# EAGLE design atmega8_bk (EAGLE 7.1.0)
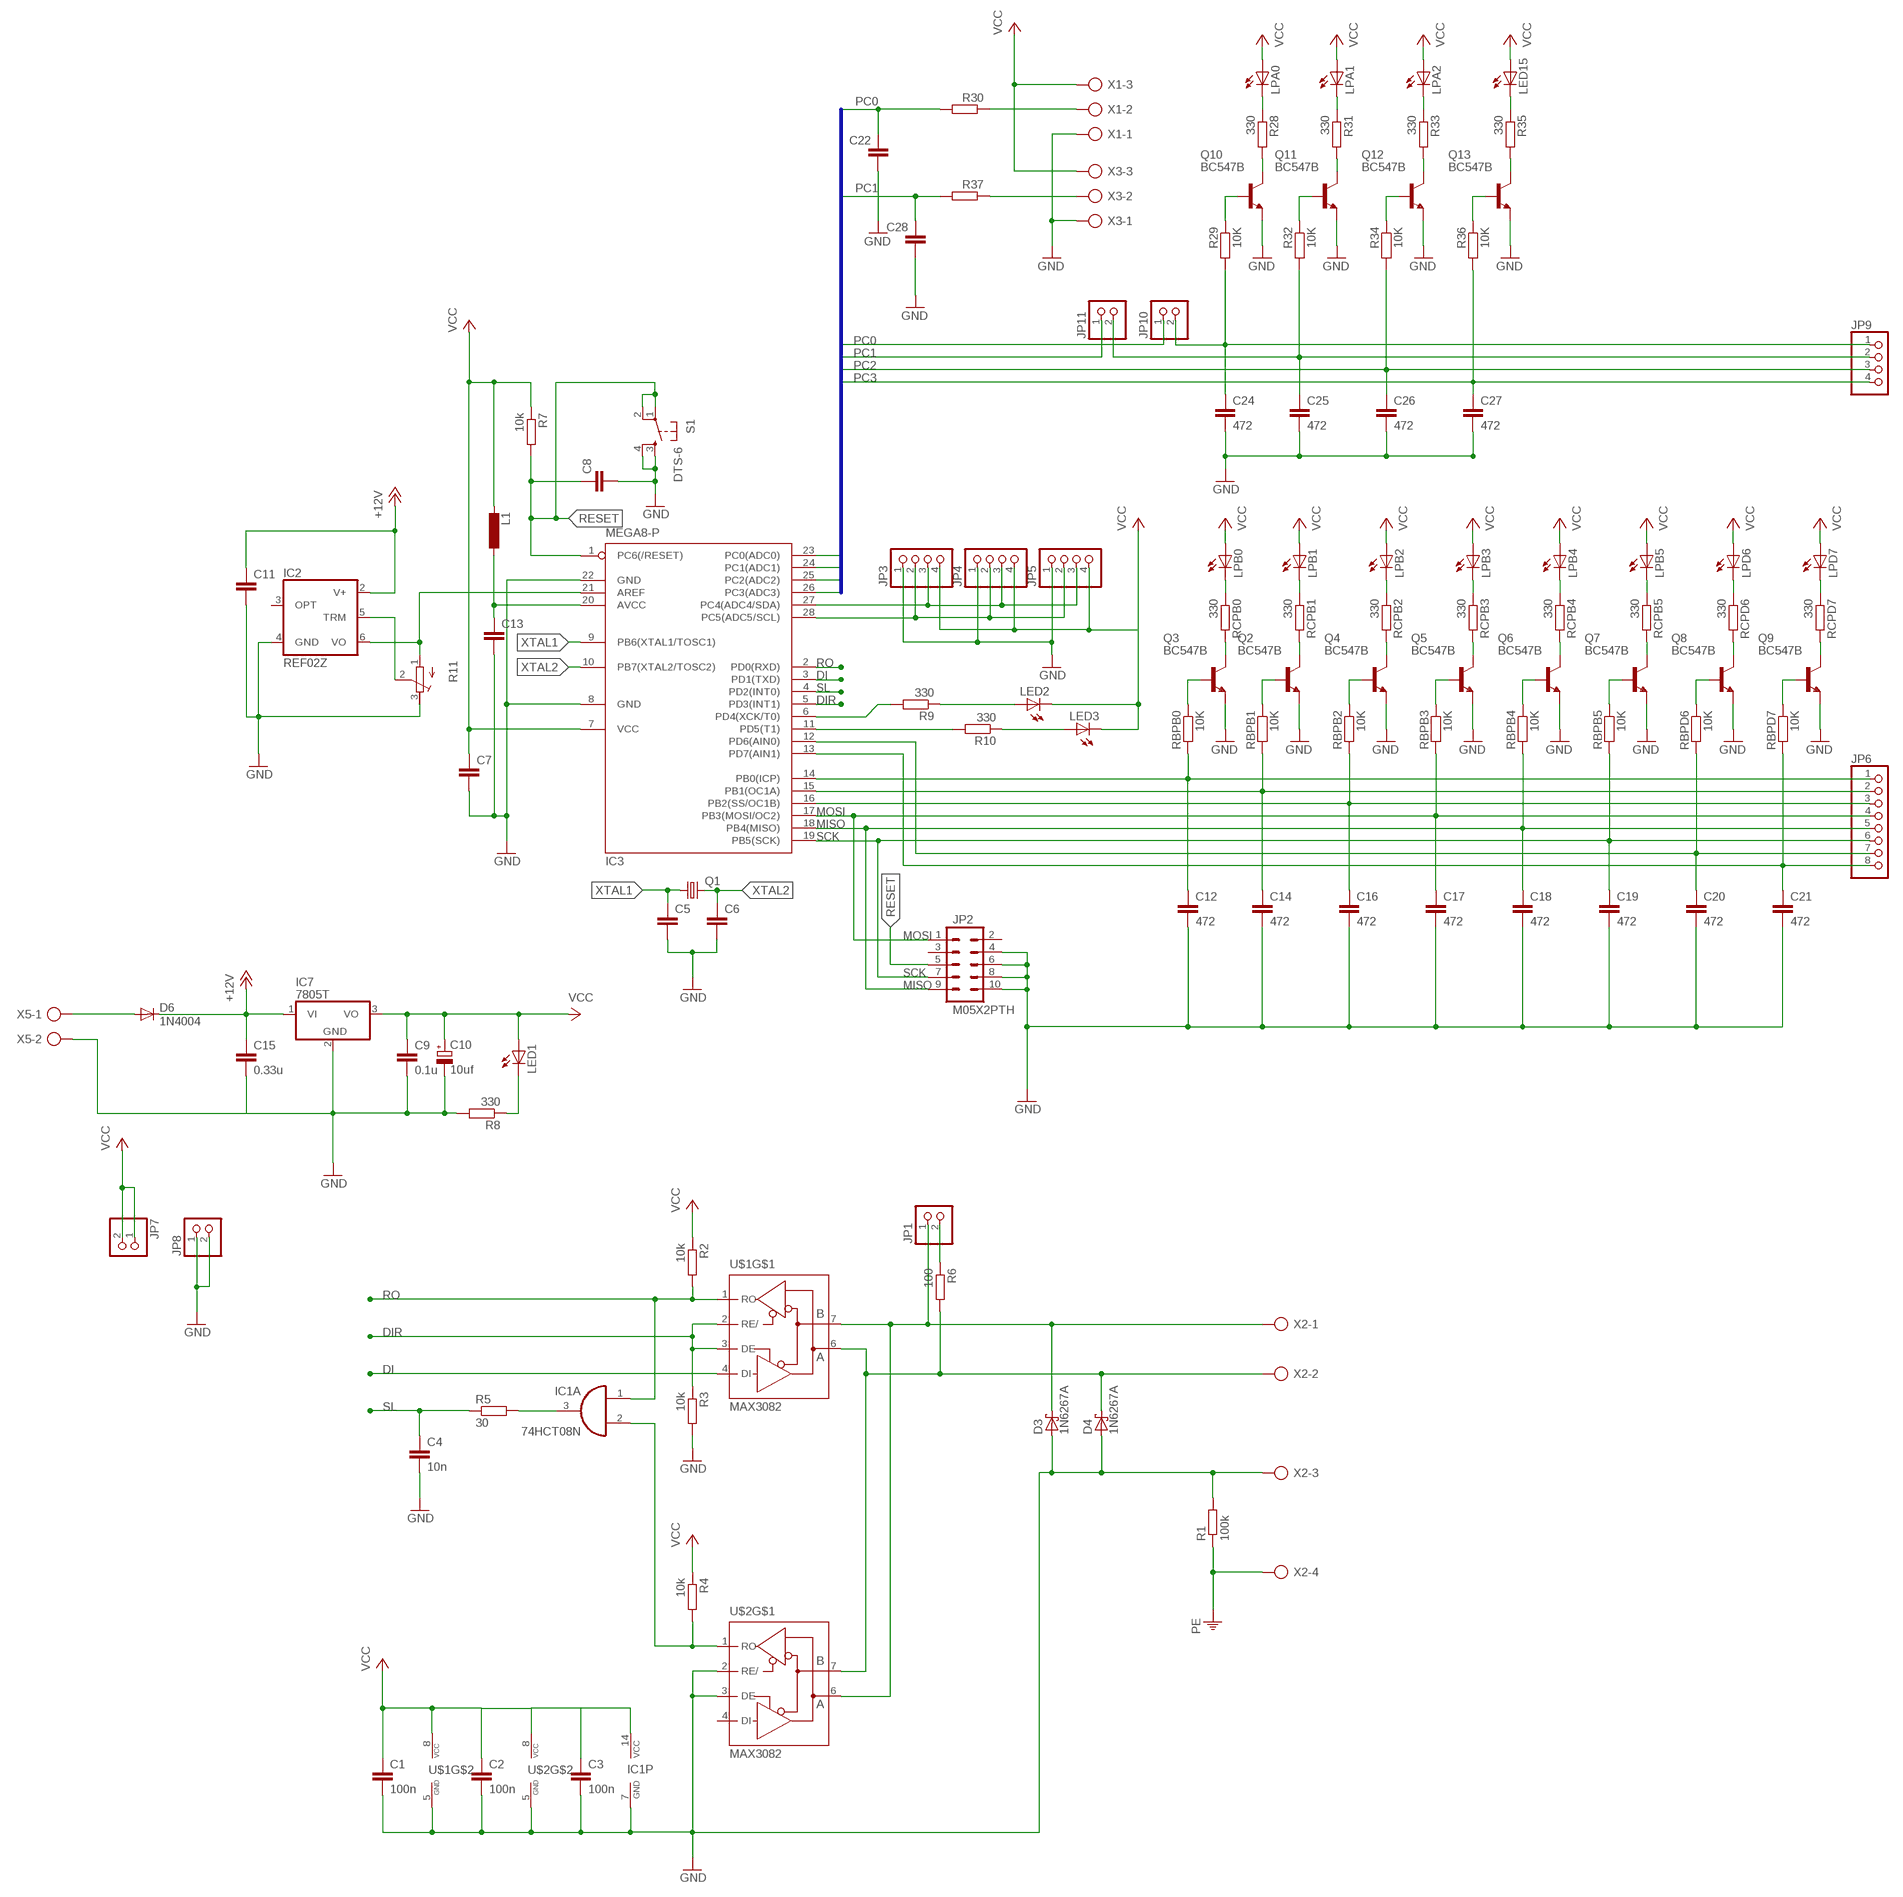
[diagram p0: schematic, sheet 1]

## Parts
C1  100n  C-EU050-035X075  [C050-035X075]
C2  100n  C-EU050-035X075  [C050-035X075]
C3  100n  C-EU050-035X075  [C050-035X075]
C4  10n  C-EU050-035X075  [C050-035X075]
C5  C-EU050-024X044  [C050-024X044]
C6  C-EU050-024X044  [C050-024X044]
C7  C-EU050-025X075  [C050-025X075]
C8  C-EU050-025X075  [C050-025X075]
C9  0.1u  C-EU025-024X044  [C025-024X044]
C10  10uf  CPOL-EUE2-4  [E2-4]
C11  C-EU050-025X075  [C050-025X075]
C12  472  C-EU050-024X044  [C050-024X044]
C13  C-EU050-025X075  [C050-025X075]
C14  472  C-EU050-024X044  [C050-024X044]
C15  0.33u  C-EU025-024X044  [C025-024X044]
C16  472  C-EU050-024X044  [C050-024X044]
C17  472  C-EU050-024X044  [C050-024X044]
C18  472  C-EU050-024X044  [C050-024X044]
C19  472  C-EU050-024X044  [C050-024X044]
C20  472  C-EU050-024X044  [C050-024X044]
C21  472  C-EU050-024X044  [C050-024X044]
C22  C-EU050-025X075  [C050-025X075]
C24  472  C-EU050-024X044  [C050-024X044]
C25  472  C-EU050-024X044  [C050-024X044]
C26  472  C-EU050-024X044  [C050-024X044]
C27  472  C-EU050-024X044  [C050-024X044]
C28  C-EU050-025X075  [C050-025X075]
D3  1N6267A  [C4111-15]
D4  1N6267A  [C4111-15]
D6  1N4004  [DO41-10]
IC1  74HCT08N  [DIL14]
IC2  REF02Z  [DIL08]
IC3  MEGA8-P  [DIL28-3]
IC7  7805T  [TO220H]
JP1  PINHD-1X2  [1X02]
JP2  M05X2PTH  [AVR_ICSP]
JP3  PINHD-1X4  [1X04]
JP4  PINHD-1X4  [1X04]
JP5  PINHD-1X4  [1X04]
JP6  PINHD-1X8  [1X08]
JP7  PINHD-1X2  [1X02]
JP8  PINHD-1X2  [1X02]
JP9  PINHD-1X4  [1X04]
JP10  PINHD-1X2  [1X02]
JP11  PINHD-1X2  [1X02]
L1  L-EU0207/12  [0207/12]
LED1  LED3MM  [LED3MM]
LED2  LED3MM  [LED3MM]
LED3  LED3MM  [LED3MM]
LED15  LED3MM  [LED3MM]
LPA0  LED3MM  [LED3MM]
LPA1  LED3MM  [LED3MM]
LPA2  LED3MM  [LED3MM]
LPB0  LED3MM  [LED3MM]
LPB1  LED3MM  [LED3MM]
LPB2  LED3MM  [LED3MM]
LPB3  LED3MM  [LED3MM]
LPB4  LED3MM  [LED3MM]
LPB5  LED3MM  [LED3MM]
LPD6  LED3MM  [LED3MM]
LPD7  LED3MM  [LED3MM]
Q1  CRYSTALHC49U70  [HC49U70]
Q2  BC547B  [TO92]
Q3  BC547B  [TO92]
Q4  BC547B  [TO92]
Q5  BC547B  [TO92]
Q6  BC547B  [TO92]
Q7  BC547B  [TO92]
Q8  BC547B  [TO92]
Q9  BC547B  [TO92]
Q10  BC547B  [TO92]
Q11  BC547B  [TO92]
Q12  BC547B  [TO92]
Q13  BC547B  [TO92]
R1  100k  R-EU_0204/7  [0204/7]
R2  10k  R-EU_0204/7  [0204/7]
R3  10k  R-EU_0204/7  [0204/7]
R4  10k  R-EU_0204/7  [0204/7]
R5  30  R-EU_0207/10  [0207/10]
R6  100  R-EU_0204/7  [0204/7]
R7  10k  R-EU_0204/7  [0204/7]
R8  330  R-EU_0204/7  [0204/7]
R9  330  R-EU_0204/7  [0204/7]
R10  330  R-EU_0204/7  [0204/7]
R11  R-TRIMM64W  [RTRIM64W]
R28  330  R-EU_0204/7  [0204/7]
R29  10K  R-EU_0204/7  [0204/7]
R30  R-EU_0204/7  [0204/7]
R31  330  R-EU_0204/7  [0204/7]
R32  10K  R-EU_0204/7  [0204/7]
R33  330  R-EU_0204/7  [0204/7]
R34  10K  R-EU_0204/7  [0204/7]
R35  330  R-EU_0204/7  [0204/7]
R36  10K  R-EU_0204/7  [0204/7]
R37  R-EU_0204/7  [0204/7]
RBPB0  10K  R-EU_0204/7  [0204/7]
RBPB1  10K  R-EU_0204/7  [0204/7]
RBPB2  10K  R-EU_0204/7  [0204/7]
RBPB3  10K  R-EU_0204/7  [0204/7]
RBPB4  10K  R-EU_0204/7  [0204/7]
RBPB5  10K  R-EU_0204/7  [0204/7]
RBPD6  10K  R-EU_0204/7  [0204/7]
RBPD7  10K  R-EU_0204/7  [0204/7]
RCPB0  330  R-EU_0204/7  [0204/7]
RCPB1  330  R-EU_0204/7  [0204/7]
RCPB2  330  R-EU_0204/7  [0204/7]
RCPB3  330  R-EU_0204/7  [0204/7]
RCPB4  330  R-EU_0204/7  [0204/7]
RCPB5  330  R-EU_0204/7  [0204/7]
RCPD6  330  R-EU_0204/7  [0204/7]
RCPD7  330  R-EU_0204/7  [0204/7]
S1  DTS-6  [DTS-6]
U$1  MAX3082  [DIL08]
U$2  MAX3082  [DIL08]
X1  AK500/3  [AK500/3]
X2  AK500/4  [AK500/4]
X3  AK500/3  [AK500/3]
X5  AK500/2  [AK500/2]

## Nets
+12V: C11.1 C15.1 D6.C IC2.2(V+) IC7.1(VI)
AREF: IC2.6(VO) IC3.21(AREF) R11.1(A)
DI: IC3.3(PD1(TXD)) U$1.4(DI)
DIR: IC3.5(PD3(INT1)) R3.1 U$1.2(RE/) U$1.3(DE)
GND: C1.2 C2.2 C3.2 C4.2 C5.2 C6.2 C7.2 C8.2 C9.2 C10.- C11.2 C12.2 C13.2 C14.2 C15.2 C16.2 C17.2 C18.2 C19.2 C20.2 C21.2 C22.2 C24.2 C25.2 C26.2 C27.2 C28.2 D3.A D4.A IC1.7(P:GND) IC2.4(GND) IC3.8(GND) IC3.22(GND) IC7.2(GND) JP2.4 JP2.6 JP2.8 JP2.10 JP3.1 JP4.1 JP5.1 JP8.1 JP8.2 Q2.1(E) Q3.1(E) Q4.1(E) Q5.1(E) Q6.1(E) Q7.1(E) Q8.1(E) Q9.1(E) Q10.1(E) Q11.1(E) Q12.1(E) Q13.1(E) R1.2 R3.2 R8.2 R11.3(E) S1.3 S1.4 U$1.5(GND) U$2.2(RE/) U$2.3(DE) U$2.5(GND) X1.1 X2.3 X3.1 X5.2
LPA3: LED15.K(C) R35.1
MISO: C18.1 IC3.18(PB4(MISO)) JP2.9 JP6.5 RBPB4.2
MOSI: C17.1 IC3.17(PB3(MOSI/OC2)) JP2.1 JP6.4 RBPB3.2
N$1: LPB0.K(C) RCPB0.1
N$2: D4.C R6.2 U$1.6(A) U$2.7(B) X2.2
N$3: IC1.2(A:I1) R4.2 U$2.1(RO)
N$4: LED1.K(C) R8.1
N$5: LED3.A R10.1
N$6: IC2.5(TRM) R11.2(S)
N$7: IC1.3(A:O) R5.2
N$8: JP1.2 R6.1
N$9: D3.C JP1.1 U$1.7(B) U$2.6(A) X2.1
N$10: C13.1 IC3.20(AVCC) L1.1
N$11: Q3.3(C) RCPB0.2
N$12: Q3.2(B) RBPB0.1
N$13: C12.1 IC3.14(PB0(ICP)) JP6.1 RBPB0.2
N$14: C14.1 IC3.15(PB1(OC1A)) JP6.2 RBPB1.2
N$15: C16.1 IC3.16(PB2(SS/OC1B)) JP6.3 RBPB2.2
N$16: C20.1 IC3.12(PD6(AIN0)) JP6.7 RBPD6.2
N$17: C21.1 IC3.13(PD7(AIN1)) JP6.8 RBPD7.2
N$18: IC3.28(PC5(ADC5/SCL)) JP3.2 JP4.2 JP5.2
N$19: D6.A X5.1
N$20: Q2.3(C) RCPB1.2
N$21: Q2.2(B) RBPB1.1
N$23: IC3.27(PC4(ADC4/SDA)) JP3.3 JP4.3 JP5.3
N$25: IC3.6(PD4(XCK/T0)) R9.2
N$26: IC3.11(PD5(T1)) R10.2
N$27: LPB1.K(C) RCPB1.1
N$28: LED2.A R9.1
N$29: Q4.3(C) RCPB2.2
N$30: Q4.2(B) RBPB2.1
N$31: LPB2.K(C) RCPB2.1
N$32: Q5.3(C) RCPB3.2
N$33: Q5.2(B) RBPB3.1
N$34: LPB3.K(C) RCPB3.1
N$35: Q6.3(C) RCPB4.2
N$36: Q6.2(B) RBPB4.1
N$37: LPB4.K(C) RCPB4.1
N$38: Q7.3(C) RCPB5.2
N$39: Q7.2(B) RBPB5.1
N$40: LPB5.K(C) RCPB5.1
N$41: Q8.3(C) RCPD6.2
N$42: Q8.2(B) RBPD6.1
N$43: LPD6.K(C) RCPD6.1
N$44: Q9.3(C) RCPD7.2
N$45: Q9.2(B) RBPD7.1
N$46: LPD7.K(C) RCPD7.1
N$47: R30.1 X1.2
N$48: Q10.3(C) R28.2
N$49: Q10.2(B) R29.1
N$50: C24.1 JP9.1 JP10.2 R29.2
N$51: C25.1 JP9.2 JP11.2 R32.2
N$53: LPA0.K(C) R28.1
N$54: Q11.3(C) R31.2
N$55: Q11.2(B) R32.1
N$56: LPA1.K(C) R31.1
N$57: Q12.3(C) R33.2
N$58: Q12.2(B) R34.1
N$59: LPA2.K(C) R33.1
N$60: Q13.3(C) R35.2
N$61: Q13.2(B) R36.1
N$71: R37.1 X3.2
PC0: C22.1 IC3.23(PC0(ADC0)) JP10.1 R30.2
PC1: C28.1 IC3.24(PC1(ADC1)) JP11.1 R37.2
PC2: C26.1 IC3.25(PC2(ADC2)) JP9.3 R34.2
PC3: C27.1 IC3.26(PC3(ADC3)) JP9.4 R36.2
PE: R1.1 X2.4
RESET: C8.1 IC3.1(PC6(/RESET)) JP2.5 R7.2 S1.1 S1.2
RO: IC1.1(A:I0) IC3.2(PD0(RXD)) R2.2 U$1.1(RO)
SCK: C19.1 IC3.19(PB5(SCK)) JP2.7 JP6.6 RBPB5.2
SL: C4.1 IC3.4(PD2(INT0)) R5.1
VCC: C1.1 C2.1 C3.1 C7.1 C9.1 C10.+ IC1.14(P:VCC) IC3.7(VCC) IC7.3(VO) JP3.4 JP4.4 JP5.4 JP7.1 JP7.2 L1.2 LED1.A LED2.K(C) LED3.K(C) LED15.A LPA0.A LPA1.A LPA2.A LPB0.A LPB1.A LPB2.A LPB3.A LPB4.A LPB5.A LPD6.A LPD7.A R2.1 R4.1 R7.1 U$1.8(VCC) U$2.8(VCC) X1.3 X3.3
XTAL1: C5.1 IC3.9(PB6(XTAL1/TOSC1)) Q1.1
XTAL2: C6.1 IC3.10(PB7(XTAL2/TOSC2)) Q1.2
Unconnected: IC1.4(B:I0) IC1.5(B:I1) IC1.6(B:O) IC1.8(C:O) IC1.9(C:I0) IC1.10(C:I1) IC1.11(D:O) IC1.12(D:I0) IC1.13(D:I1) IC2.3(OPT) JP2.2 JP2.3 U$2.4(DI)

## Buses
PC[0..3]

## Library data of the parts
C1-C9 C11-C22 C24-C28 = rcl:C-EU: CAPACITOR, European symbol
C10 = rcl:CPOL-EU: POLARIZED CAPACITOR, European symbol
D3 D4 = diode:1N6267A: DIODE transient voltage suppressor
D6 = diode:1N4004: DIODE general purpose rectifier, 1 A
IC1 = 74xx-eu:74*08: Quad 2-input AND gate
IC2 = linear:REF02: VOLTAGE REFERENCE
IC3 = atmel:MEGA8-P: MICROCONTROLLER 8 Kbytes FLASH, 1 kbytes SRAM, 512 bytes EEPROM, USART, 4-channel 10 bit ADC, 2-channel 8 bit ADC Pin compatible with Atmega48, ATMega88, ATMega168 Source: avr.lbr; OC_FARNELL: unknown; OC_NEWARK: unknown
IC7 = linear:78*: Positive VOLTAGE REGULATOR Source: http://cache.national.com/ds/LM/LM78L05.pdf http://www.fairchildsemi.com/ds/LM/LM7805.pdf
JP1 JP7 JP8 JP10 JP11 = pinhead:PINHD-1X2: PIN HEADER
JP2 = SparkFun:M05X2: Header 5x2 Standard 10-pin dual row 0.1" header. Commonly used with AVR-ISP. Use with Spark Fun Electronics SKU: PRT-00778
JP3-JP5 JP9 = pinhead:PINHD-1X4: PIN HEADER
JP6 = pinhead:PINHD-1X8: PIN HEADER
L1 = rcl:L-EU: INDUCTOR, European symbol
LED1-LED3 LED15 LPA0 LPA1 LPA2 LPB0 LPB1-LPB5 LPD6 LPD7 = led:LED: LED OSRAM: - CHIPLED LG R971, LG N971, LY N971, LG Q971, LY Q971, LO R971, LY R971 LH N974, LH R974 LS Q976, LO Q976, LY Q976 LO Q996 - Hyper CHIPLED LW Q18S LB Q993, LB Q99A, LB R99A - SideLED LS A670, LO A670, LY A670, LG A670, LP A670 LB A673, LV A673, LT A673, LW A673 LH A674 LY A675 LS A676, LA A676, LO A676, LY A676, LW A676 LS A679, LY A679, LG A679 - Hyper Micro SIDELED® LS Y876, LA Y876, LO Y876, LY Y876 LT Y87S - SmartLED LW L88C, LW L88S LB L89C, LB L89S, LG L890 LS L89K, LO L89K, LY L89K LS L896, LA L896, LO L896, LY L896 - TOPLED LS T670, LO T670, LY T670, LG T670, LP T670 LSG T670, LSP T670, LSY T670, LOP T670, LYG T670 LG T671, LOG T671, LSG T671 LB T673, LV T673, LT T673, LW T673 LH T674 LS T676, LA T676, LO T676, LY T676, LB T676, LH T676, LSB T676, LW T676 LB T67C, LV T67C, LT T67C, LS T67K, LO T67K, LY T67K, LW E67C LS E67B, LA E67B, LO E67B, LY E67B, LB E67C, LV E67C, LT E67C LW T67C LS T679, LY T679, LG T679 LS T770, LO T770, LY T770, LG T770, LP T770 LB T773, LV T773, LT T773, LW T773 LH T774 LS E675, LA E675, LY E675, LS T675 LS T776, LA T776, LO T776, LY T776, LB T776 LHGB T686 LT T68C, LB T68C - Hyper Mini TOPLED® LB M676 - Mini TOPLED Santana® LG M470 LS M47K, LO M47K, LY M47K Source: http://www.osram.convergy.de LUXEON: - LUMILED® LXK2-PW12-R00, LXK2-PW12-S00, LXK2-PW14-U00, LXK2-PW14-V00 LXK2-PM12-R00, LXK2-PM12-S00, LXK2-PM14-U00 LXK2-PE12-Q00, LXK2-PE12-R00, LXK2-PE12-S00, LXK2-PE14-T00, LXK2-PE14-U00 LXK2-PB12-K00, LXK2-PB12-L00, LXK2-PB12-M00, LXK2-PB14-N00, LXK2-PB14-P00, LXK2-PB14-Q00 LXK2-PR12-L00, LXK2-PR12-M00, LXK2-PR14-Q00, LXK2-PR14-R00 LXK2-PD12-Q00, LXK2-PD12-R00, LXK2-PD12-S00 LXK2-PH12-R00, LXK2-PH12-S00 LXK2-PL12-P00, LXK2-PL12-Q00, LXK2-PL12-R00 Source: www.luxeon.com KINGBRIGHT: KA-3528ASYC Source: www.kingbright.com
Q1 = crystal:CRYSTAL: CRYSTAL; OC_FARNELL: unknown; OC_NEWARK: unknown
Q2-Q13 = transistor-npn:BC547*: NPN Transistor
R1-R4 R6 = resistor:R-EU_: RESISTOR, European symbol
R5 R7-R10 R28-R37 RBPB0 RBPB1-RBPB5 RBPD6 RBPD7 RCPB0 RCPB1-RCPB5 RCPD6 RCPD7 = rcl:R-EU_: RESISTOR, European symbol
R11 = rcl:R-TRIMM: Trimm resistor
S1 = switch-tact:DTS-6
U$1 U$2 = maxim:MAX3082
X1 X3 = con-ptr500:AK500/3: CONNECTOR; OC_FARNELL: unknown; OC_NEWARK: unknown
X2 = con-ptr500:AK500/4: CONNECTOR; OC_FARNELL: unknown; OC_NEWARK: unknown
X5 = con-ptr500:AK500/2: CONNECTOR; OC_FARNELL: unknown; OC_NEWARK: unknown

## Board
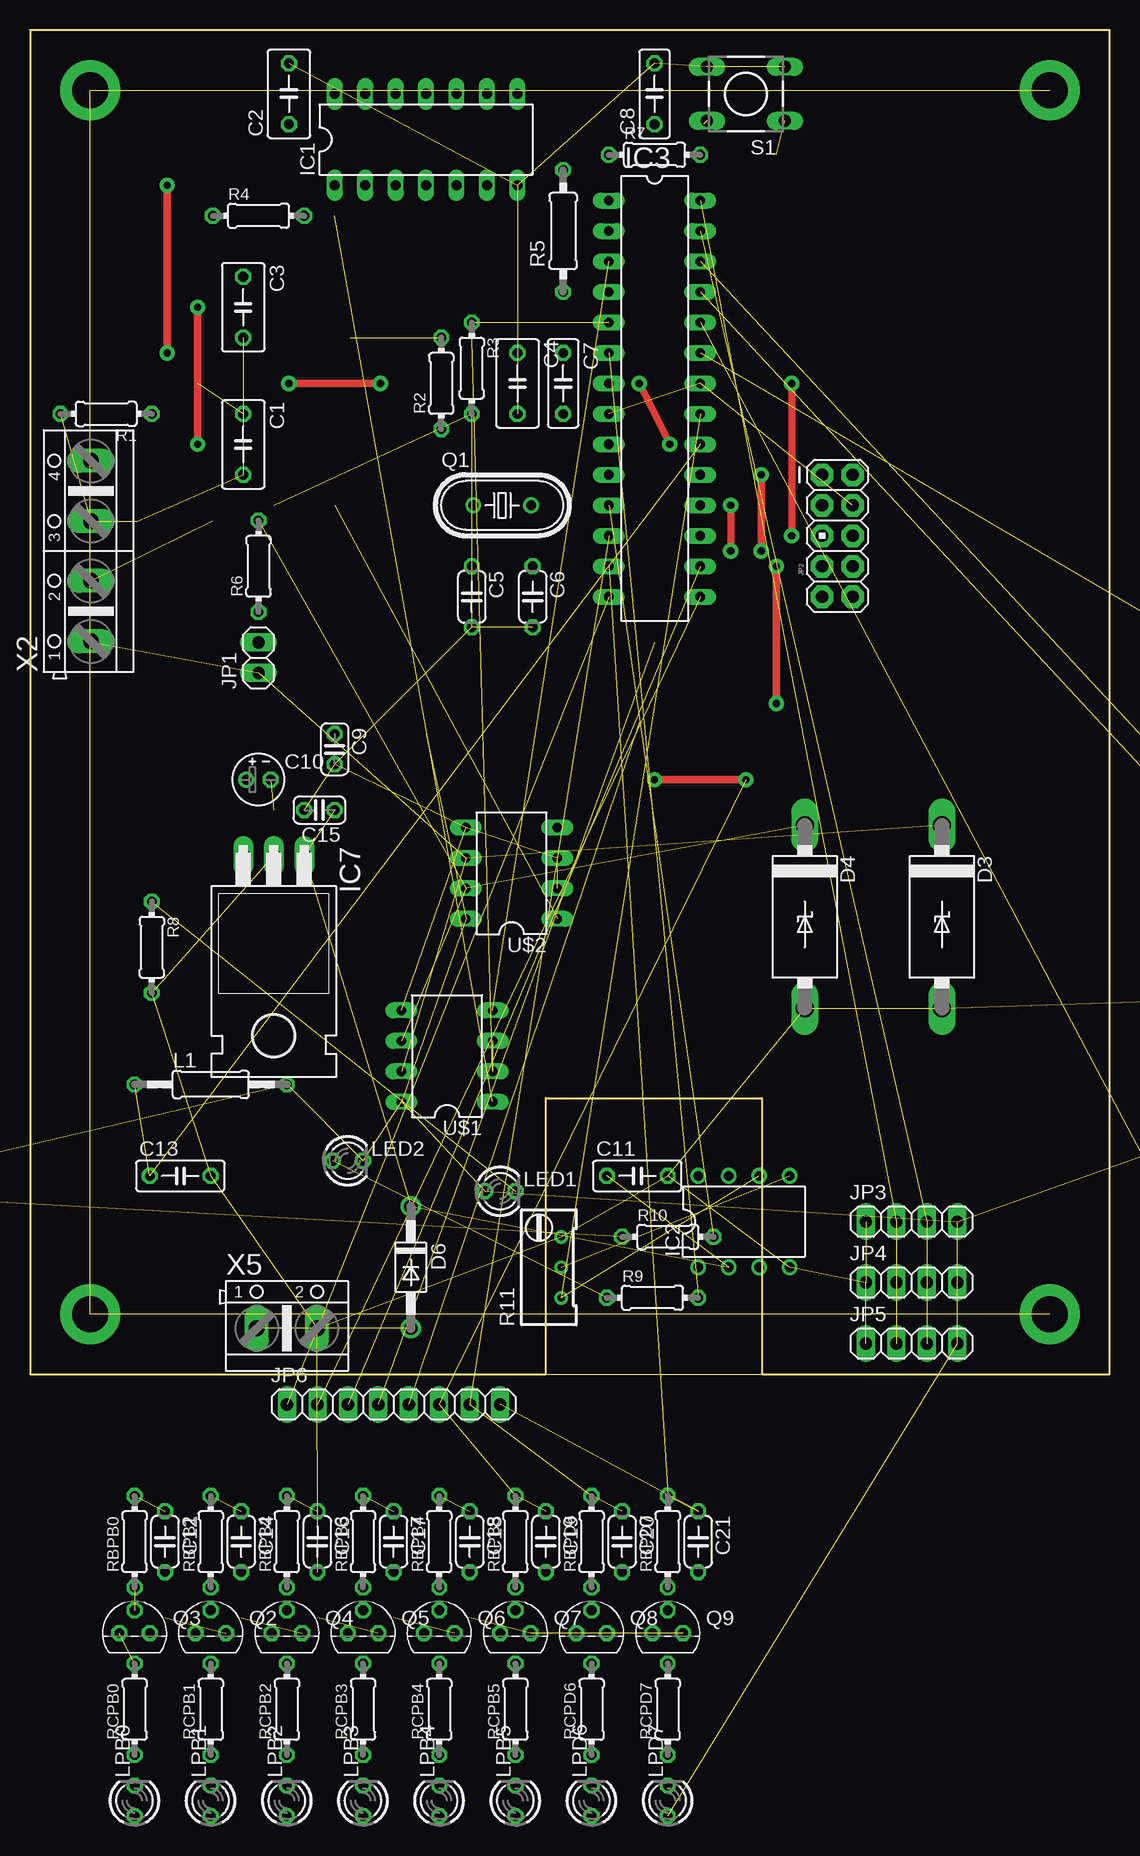
[diagram p1: board, top side]
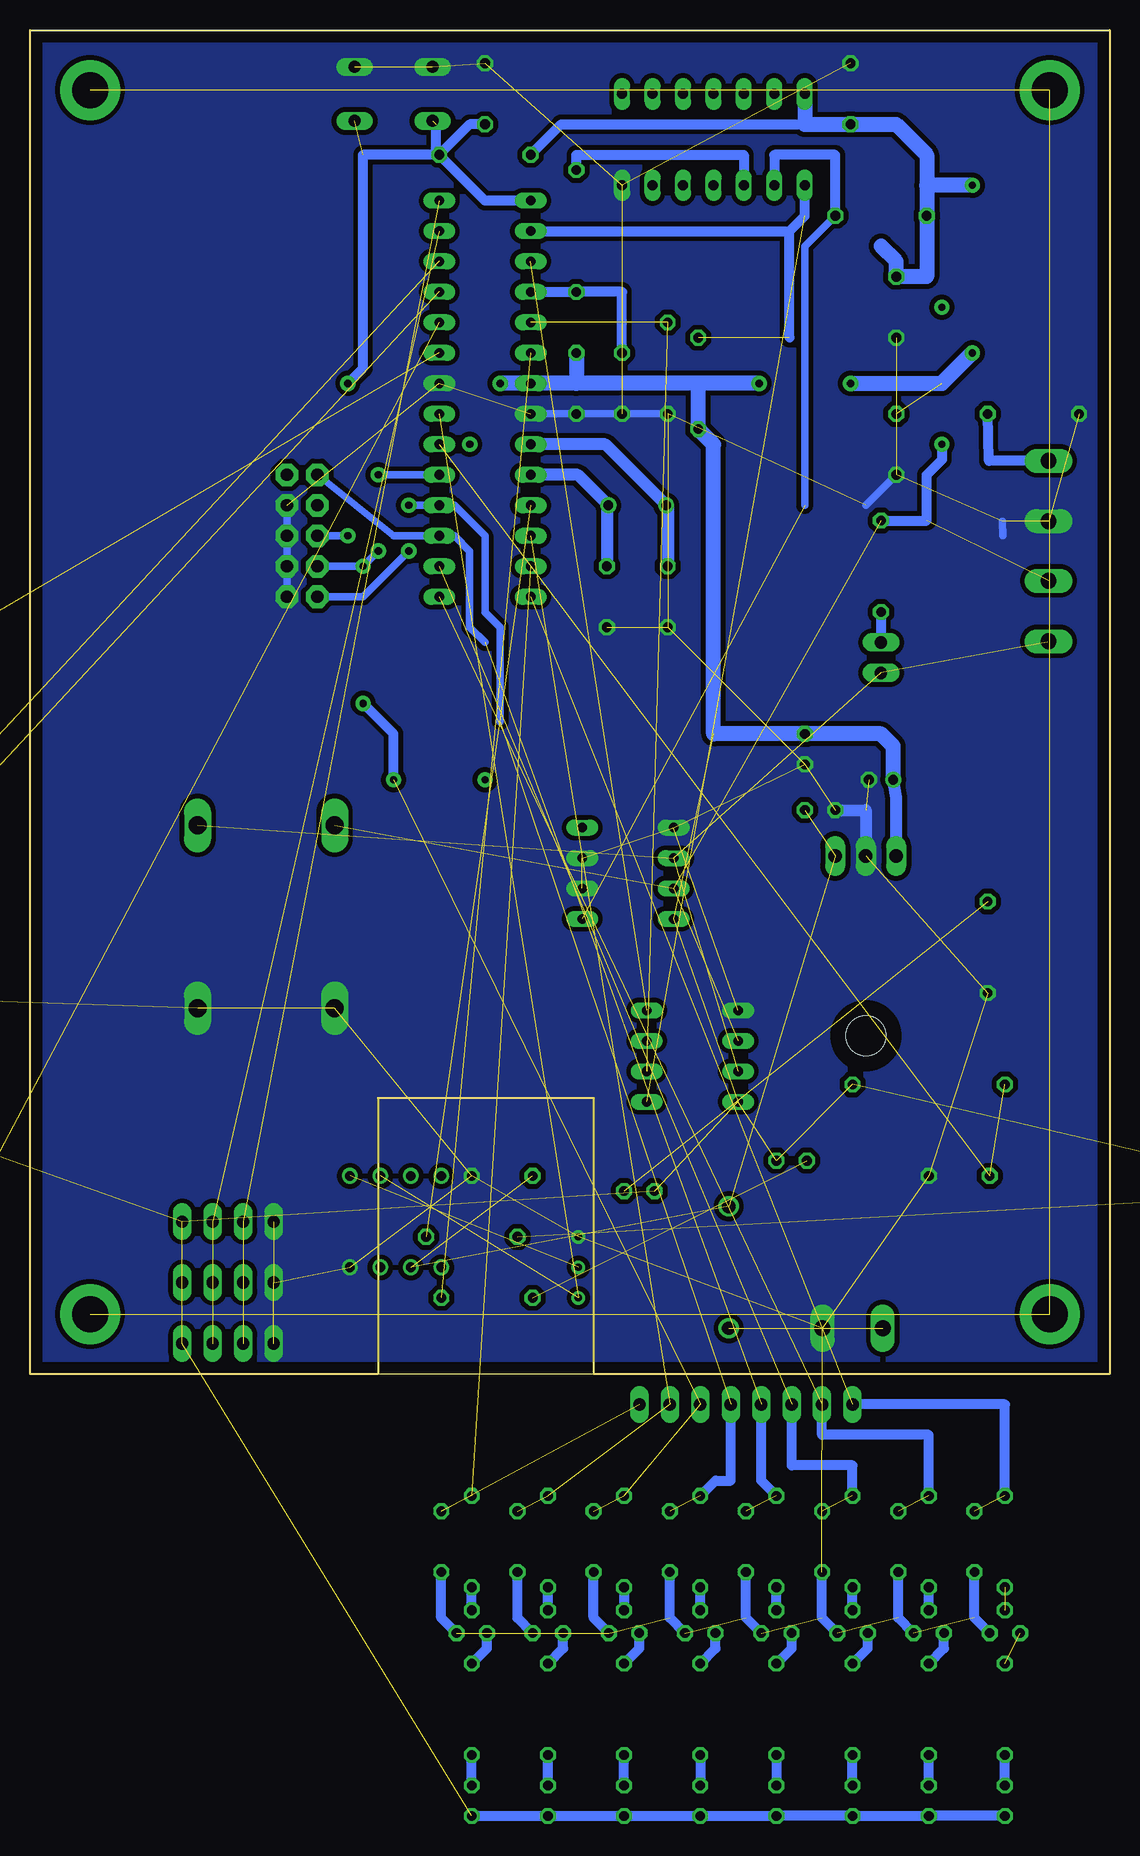
[diagram p2: board, bottom side, seen from below]

Size 90 x 112 mm. Coordinates in mm from the lower left corner, seen from the top.
Outline: 0,0 90,0 90,112 0,112 0,0
Copper layers (1*16): Top 0.035mm / dielectric 1.5mm / Bottom 0.035mm
Design rules "default": minimum track width 10mil, minimum drill 24mil, track to track 8mil, track to pad 8mil, pad to pad 8mil, via to via 8mil, smd to smd 8mil, copper to edge 40mil, drill to drill 8mil, minimum pad ring 10mil, minimum via ring 8mil, stop-mask expansion 4mil, vias tented up to drill 0mil, thermal gap 10mil
Milling: 8 lines

### Footprints (pad centres in the part's own frame; a part is rotated, then mirrored left to right if it is on the bottom)
C050-035X075 = drill 0.813 octagon: 1 -2.54,0; 2 2.54,0
C050-024X044 = drill 0.813 octagon: 1 -2.54,0; 2 2.54,0
C050-025X075 = drill 0.813 octagon: 1 -2.54,0; 2 2.54,0
C025-024X044 = drill 0.813 octagon: 1 -1.27,0; 2 1.27,0
E2-4 = drill 0.813 pad 1.27: + -1.016,0 | drill 0.813 pad 1.27 octagon: - 1.016,0
C4111-15 = drill 1.499 long: A 7.62,0; C -7.62,0
DO41-10 = drill 1.118: A 5.08,0; C -5.08,0
DIL14 = drill 0.813 long: 1 -7.62,-3.81; 2 -5.08,-3.81; 3 -2.54,-3.81; 4 0,-3.81; 5 2.54,-3.81; 6 5.08,-3.81; 7 7.62,-3.81; 8 7.62,3.81; 9 5.08,3.81; 10 2.54,3.81; 11 0,3.81; 12 -2.54,3.81; 13 -5.08,3.81; 14 -7.62,3.81
DIL08 = drill 0.813 pad 1.27: 1 -3.81,-3.81; 2 -1.27,-3.81; 3 1.27,-3.81; 4 3.81,-3.81; 5 3.81,3.81; 6 1.27,3.81; 7 -1.27,3.81; 8 -3.81,3.81
DIL28-3 = drill 0.813 long: 1 -16.51,-3.81; 2 -13.97,-3.81; 3 -11.43,-3.81; 4 -8.89,-3.81; 5 -6.35,-3.81; 6 -3.81,-3.81; 7 -1.27,-3.81; 8 1.27,-3.81; 9 3.81,-3.81; 10 6.35,-3.81; 11 8.89,-3.81; 12 11.43,-3.81; 13 13.97,-3.81; 14 16.51,-3.81; 15 16.51,3.81; 16 13.97,3.81; 17 11.43,3.81; 18 8.89,3.81; 19 6.35,3.81; 20 3.81,3.81; 21 1.27,3.81; 22 -1.27,3.81; 23 -3.81,3.81; 24 -6.35,3.81; 25 -8.89,3.81; 26 -11.43,3.81; 27 -13.97,3.81; 28 -16.51,3.81
TO220H = drill 1.118 long: 1 -2.54,-10.16; 2 0,-10.16; 3 2.54,-10.16 | hole 3.302: 0,4.826
1X02 = drill 1.016 long: 1 -1.27,0; 2 1.27,0
AVR_ICSP = drill 1.016 pad 1.88 octagon: 1 -1.27,5.08; 2 1.27,5.08; 3 -1.27,2.54; 4 1.27,2.54; 5 -1.27,0; 6 1.27,0; 7 -1.27,-2.54; 8 1.27,-2.54; 9 -1.27,-5.08; 10 1.27,-5.08
1X04 = drill 1.016 long: 1 -3.81,0; 2 -1.27,0; 3 1.27,0; 4 3.81,0
1X08 = drill 1.016 long: 1 -8.89,0; 2 -6.35,0; 3 -3.81,0; 4 -1.27,0; 5 1.27,0; 6 3.81,0; 7 6.35,0; 8 8.89,0
0207/12 = drill 0.813 octagon: 1 -6.35,0; 2 6.35,0
LED3MM = drill 0.813 octagon: A -1.27,0; K 1.27,0
HC49U70 = drill 0.813: 1 -2.413,0; 2 2.413,0
TO92 = drill 0.813 octagon: 1 1.27,0; 2 0,1.905; 3 -1.27,0
0204/7 = drill 0.813 octagon: 1 -3.81,0; 2 3.81,0
0207/10 = drill 0.813 octagon: 1 -5.08,0; 2 5.08,0
RTRIM64W = drill 0.61: 1 1.27,-2.54; 2 1.27,0; 3 1.27,2.54
DTS-6 = drill 1 long: 1 -3.25,2.25; 2 3.25,2.25; 3 -3.25,-2.25; 4 3.25,-2.25
DIL08' = drill 0.813 long: 1 -3.81,-3.81; 2 -1.27,-3.81; 3 1.27,-3.81; 4 3.81,-3.81; 5 3.81,3.81; 6 1.27,3.81; 7 -1.27,3.81; 8 -3.81,3.81
AK500/3 = drill 1.321 long: 1 -5.004,0; 2 0,0; 3 5.004,0
AK500/4 = drill 1.321 long: 1 -7.518,0; 2 -2.489,0; 3 2.489,0; 4 7.518,0
AK500/2 = drill 1.321 long: 1 -2.515,0; 2 2.515,0

### Placement (x,y rotation side)
C1  17.78,77.47 270 top
C2  21.59,106.68 90 top
C3  17.78,88.9 270 top
C4  40.64,82.55 270 top
C5  36.83,64.77 270 top
C6  41.91,64.77 270 top
C7  44.45,82.55 270 top
C8  52.07,106.68 90 top
C9  25.4,52.07 270 top
C10  19.05,49.53 0 top
C11  50.63,16.51 0 top
C12  11.26,-13.97 270 top  (outside the outline)
C13  12.53,16.51 0 top
C14  17.61,-13.97 270 top  (outside the outline)
C15  24.13,46.99 180 top
C16  23.96,-13.97 270 top  (outside the outline)
C17  30.31,-13.97 270 top  (outside the outline)
C18  36.66,-13.97 270 top  (outside the outline)
C19  43.01,-13.97 270 top  (outside the outline)
C20  49.36,-13.97 270 top  (outside the outline)
C21  55.71,-13.97 270 top  (outside the outline)
C22  153.5,13.97 0 top  (outside the outline)
C24  147.15,-67.31 0 top  (outside the outline)
C25  153.5,-73.66 0 top  (outside the outline)
C26  153.5,-80.01 0 top  (outside the outline)
C27  153.5,-86.36 0 top  (outside the outline)
C28  153.5,-116.84 0 top  (outside the outline)
D3  76.03,38.1 270 top
D4  64.6,38.1 270 top
D6  31.75,8.89 270 top
IC1  33.02,102.87 0 top
IC2  59.52,12.7 0 top
IC3  52.07,81.28 270 top
IC7  20.32,33.02 180 top
JP1  19.05,59.69 90 top
JP2  67.31,69.85 0 top
JP3  73.49,12.7 0 top
JP4  73.49,7.62 0 top
JP5  73.49,2.54 0 top
JP6  30.31,-2.54 0 top
JP7  153.5,39.37 0 top  (outside the outline)
JP8  153.5,33.02 0 top  (outside the outline)
JP9  156.04,-19.05 0 top  (outside the outline)
JP10  153.5,-25.4 0 top  (outside the outline)
JP11  153.5,-93.98 0 top  (outside the outline)
L1  15.07,24.13 0 top
LED1  39.2,15.24 0 top
LED2  26.5,17.78 0 top
LED3  -17.95,15.24 0 top  (outside the outline)
LED15  163.66,-45.72 0 top  (outside the outline)
LPA0  152.23,-40.64 0 top  (outside the outline)
LPA1  163.66,-40.64 0 top  (outside the outline)
LPA2  152.23,-45.72 0 top  (outside the outline)
LPB0  8.72,-35.56 90 top  (outside the outline)
LPB1  15.07,-35.56 90 top  (outside the outline)
LPB2  21.42,-35.56 90 top  (outside the outline)
LPB3  27.77,-35.56 90 top  (outside the outline)
LPB4  34.12,-35.56 90 top  (outside the outline)
LPB5  40.47,-35.56 90 top  (outside the outline)
LPD6  46.82,-35.56 90 top  (outside the outline)
LPD7  53.17,-35.56 90 top  (outside the outline)
Q1  39.37,72.39 0 top
Q2  15.07,-21.59 0 top  (outside the outline)
Q3  8.72,-21.59 0 top  (outside the outline)
Q4  21.42,-21.59 0 top  (outside the outline)
Q5  27.77,-21.59 0 top  (outside the outline)
Q6  34.12,-21.59 0 top  (outside the outline)
Q7  40.47,-21.59 0 top  (outside the outline)
Q8  46.82,-21.59 0 top  (outside the outline)
Q9  53.17,-21.59 0 top  (outside the outline)
Q10  152.23,-30.48 0 top  (outside the outline)
Q11  166.2,-30.48 0 top  (outside the outline)
Q12  152.23,-35.56 0 top  (outside the outline)
Q13  166.2,-35.56 0 top  (outside the outline)
R1  6.35,80.01 180 top
R2  34.29,82.55 90 top
R3  36.83,83.82 270 top
R4  19.05,96.52 0 top
R5  44.45,95.25 90 top
R6  19.05,67.31 90 top
R7  52.07,101.6 0 top
R8  10.16,35.56 270 top
R9  51.9,6.35 0 top
R10  53.17,11.43 0 top
R11  43.01,8.89 0 top
R28  154.77,-50.8 0 top  (outside the outline)
R29  164.93,-50.8 0 top  (outside the outline)
R30  171.28,15.24 0 top  (outside the outline)
R31  154.77,-54.61 0 top  (outside the outline)
R32  164.93,-54.61 0 top  (outside the outline)
R33  154.77,-58.42 0 top  (outside the outline)
R34  164.93,-58.42 0 top  (outside the outline)
R35  154.77,-62.23 0 top  (outside the outline)
R36  164.93,-62.23 0 top  (outside the outline)
R37  154.77,-111.76 0 top  (outside the outline)
RBPB0  8.72,-13.97 90 top  (outside the outline)
RBPB1  15.07,-13.97 90 top  (outside the outline)
RBPB2  21.42,-13.97 90 top  (outside the outline)
RBPB3  27.77,-13.97 90 top  (outside the outline)
RBPB4  34.12,-13.97 90 top  (outside the outline)
RBPB5  40.47,-13.97 90 top  (outside the outline)
RBPD6  46.82,-13.97 90 top  (outside the outline)
RBPD7  53.17,-13.97 90 top  (outside the outline)
RCPB0  8.72,-27.94 90 top  (outside the outline)
RCPB1  15.07,-27.94 90 top  (outside the outline)
RCPB2  21.42,-27.94 90 top  (outside the outline)
RCPB3  27.77,-27.94 90 top  (outside the outline)
RCPB4  34.12,-27.94 90 top  (outside the outline)
RCPB5  40.47,-27.94 90 top  (outside the outline)
RCPD6  46.82,-27.94 90 top  (outside the outline)
RCPD7  53.17,-27.94 90 top  (outside the outline)
S1  59.69,106.68 180 top
U$1  MAX3082  [DIL08']  34.77,26.49 90 top
U$2  MAX3082  [DIL08']  40.15,41.73 90 top
X1  158.58,0 0 top  (outside the outline)
X2  5.08,68.58 90 top
X3  194.14,-46.99 0 top  (outside the outline)
X5  21.42,3.81 0 top

### Tracks (layer width: path | path; a pad name or v marks a point on that pad's centre or on a via)
+12V  (4 unrouted)
AREF  (2 unrouted)
DI  (1 unrouted)
DIR  (3 unrouted)
GND  (54 unrouted)
  Bottom 0.61: JP2.10 JP2.8 JP2.6 JP2.4 | IC3.8 C7.2 C4.2 R3.2 | C1.2 20.32,72.39 | 8.94,71.07 8.89,69.85
  Bottom 0.813: Q3.1 11.26,-20.32 C12.2 | Q2.1 17.61,-20.32 C14.2 | Q4.1 23.96,-20.32 C16.2 | Q5.1 30.31,-20.32 C17.2 | Q6.1 36.66,-20.32 C18.2 | Q7.1 43.01,-20.32 C19.2 | Q8.1 49.36,-20.32 C20.2 | Q9.1 55.71,-20.32 C21.2
  Bottom 1.016: C15.2 20.32,46.99 IC7.2
  pour Bottom (isolate 0.406, no thermals): 0,0 90,0 90,112 0,112
LPA3  (1 unrouted)
MISO  (via drill 0.6 pad 1.27)  (2 unrouted)
  Top 0.61: v58.42,68.58 v58.42,72.39
  Bottom 0.61: 50.8,54.36 50.8,62.23 52.07,63.5 52.07,69.85 54.61,72.39 IC3.18 v58.42,72.39 | JP2.9 62.23,64.77 v58.42,68.58
  Bottom 0.813: RBPB4.2 32.85,-8.89 31.58,-8.89 JP6.5
MOSI  (2 unrouted)
  Bottom 0.61: 52.07,60.96 53.34,62.23 53.34,68.58 54.61,69.85 IC3.17 59.69,69.85 JP2.1
  Bottom 0.813: RBPB3.2 29.04,-8.89 JP6.4
N$1
  Bottom 0.813: LPB0.K RCPB0.1
N$2  (via drill 0.6 pad 1.27)  (4 unrouted)
  Top 0.61: v13.97,88.9 v13.97,77.47
  Bottom 0.813: v13.97,77.47 13.97,76.2 15.24,74.93 15.24,71.12 R6.2
N$3  (1 unrouted)
  Bottom 0.61: 25.4,72.39 25.4,93.98 R4.2
  Bottom 0.813: IC1.2 27.94,101.6 22.86,101.6 R4.2
N$4  (1 unrouted)
N$5  (1 unrouted)
N$6  (1 unrouted)
N$7
  Bottom 0.813: R5.2 44.45,101.6 30.48,101.6 IC1.3
N$8
  Bottom 0.813: R6.1 JP1.2
N$9  (4 unrouted)
  Bottom 0.61: 5.18,60.96 X2.1
N$10  (2 unrouted)
N$11  (1 unrouted)
N$12  (1 unrouted)
N$13  (2 unrouted)
  Bottom 0.813: RBPB0.2 8.72,-2.54 JP6.1
N$14  (2 unrouted)
  Bottom 0.813: RBPB1.2 15.07,-5.08 23.96,-5.08 JP6.2
N$15  (2 unrouted)
  Bottom 0.813: RBPB2.2 21.42,-7.62 26.5,-7.62 JP6.3
N$16  (3 unrouted)
N$17  (3 unrouted)
N$18  (3 unrouted)
N$19  (1 unrouted)
N$20
  Bottom 0.813: RCPB1.2 13.8,-22.86 Q2.3
N$21
  Bottom 0.813: Q2.2 RBPB1.1
N$22  (via drill 3 pad 5)  (3 unrouted)
  other vias: 5,5 85,5 5,107 85,107
N$23  (3 unrouted)
N$25  (1 unrouted)
N$26  (1 unrouted)
N$27
  Bottom 0.813: LPB1.K RCPB1.1
N$28  (1 unrouted)
N$29
  Bottom 0.813: RCPB2.2 20.15,-22.86 Q4.3
N$30
  Bottom 0.813: Q4.2 RBPB2.1
N$31
  Bottom 0.813: LPB2.K RCPB2.1
N$32
  Bottom 0.813: RCPB3.2 26.5,-22.86 Q5.3
N$33
  Bottom 0.813: Q5.2 RBPB3.1
N$34
  Bottom 0.813: RCPB3.1 LPB3.K
N$35
  Bottom 0.813: RCPB4.2 32.85,-22.86 Q6.3
N$36
  Bottom 0.813: Q6.2 RBPB4.1
N$37
  Bottom 0.813: RCPB4.1 LPB4.K
N$38
  Bottom 0.813: RCPB5.2 39.2,-22.86 Q7.3
N$39
  Bottom 0.813: RBPB5.1 Q7.2
N$40
  Bottom 0.813: LPB5.K RCPB5.1
N$41
  Bottom 0.813: RCPD6.2 45.55,-22.86 Q8.3
N$42
  Bottom 0.813: Q8.2 RBPD6.1
N$43
  Bottom 0.813: LPD6.K RCPD6.1
N$44
  Bottom 0.813: RCPD7.2 51.9,-22.86 Q9.3
N$45
  Bottom 0.813: Q9.2 RBPD7.1
N$46
  Bottom 0.813: LPD7.K RCPD7.1
N$47  (1 unrouted)
N$48  (1 unrouted)
N$49  (1 unrouted)
N$50  (3 unrouted)
N$51  (3 unrouted)
N$53  (1 unrouted)
N$54  (1 unrouted)
N$55  (1 unrouted)
N$56  (1 unrouted)
N$57  (1 unrouted)
N$58  (1 unrouted)
N$59  (1 unrouted)
N$60  (1 unrouted)
N$61  (1 unrouted)
N$71  (1 unrouted)
PC0  (3 unrouted)
PC1  (3 unrouted)
PC2  (3 unrouted)
PC3  (3 unrouted)
PE
  Bottom 0.813: X2.4 10.06,76.1 R1.1
RESET  (via drill 0.6 pad 1.27)  (2 unrouted)
  Top 0.61: v63.5,69.85 v63.5,82.55
  Bottom 0.61: JP2.5 v63.5,69.85 | R7.2 56.15,101.6
  Bottom 0.813: v63.5,82.55 62.23,83.82 62.23,101.6 56.15,101.6 56.15,104.14 | IC3.1 52.07,97.79 R7.2 53.34,104.14 C8.1
RO  (2 unrouted)
  Bottom 0.813: 26.67,86.36 26.67,95.25 | IC3.2 26.67,95.25 | 26.67,95.25 25.4,96.52 IC1.1
SCK  (via drill 0.6 pad 1.27)  (3 unrouted)
  Top 0.61: v60.96,68.58 v60.96,74.93 | v62.23,55.88 v62.23,67.31 | v52.07,49.53 v59.69,49.53
  Bottom 0.61: JP2.7 v62.23,67.31 v60.96,68.58 | v60.96,74.93 IC3.19
  Bottom 0.813: v59.69,49.53 59.69,53.34 v62.23,55.88
SL
  Bottom 0.813: IC3.4 R5.1 40.64,90.17 C4.1
VCC  (via drill 0.6 pad 1.27)  (19 unrouted)
  Top 0.61: v50.8,82.55 v53.34,77.47 | v21.59,82.55 v29.21,82.55 | v11.43,85.09 v11.43,99.06
  Bottom 0.813: R7.1 45.72,104.14 25.4,104.14 | LPD7.A LPD6.A LPB5.A LPB4.A LPB3.A LPB2.A LPB1.A LPB0.A
  Bottom 1.016: IC7.3 17.78,48.01 C10.+
  Bottom 1.27: 19.05,93.98 17.78,92.71 C3.1 15.24,91.44 R4.1 15.24,99.06 | IC1.14 25.4,104.14 C2.1 17.78,104.14 15.24,101.6 15.24,99.06 | C10.+ 18.03,52.32 19.05,53.34 C9.1 33.02,53.34 33.02,77.47 R2.1 34.29,82.55 | 34.29,82.55 44.45,82.55 | 44.45,82.55 IC3.7 v50.8,82.55 | C7.1 44.45,82.55 | v29.21,82.55 34.29,82.55 | v21.59,82.55 13.97,82.55 v11.43,85.09 | v11.43,99.06 15.24,99.06
XTAL1
  Bottom 1.016: IC3.9 42.04,77.47 Q1.1 36.83,72.26 C5.1
XTAL2
  Bottom 1.016: IC3.10 44.32,74.93 Q1.2 41.91,72.26 C6.1